# EAGLE design pi-shield (EAGLE 8.2.1)
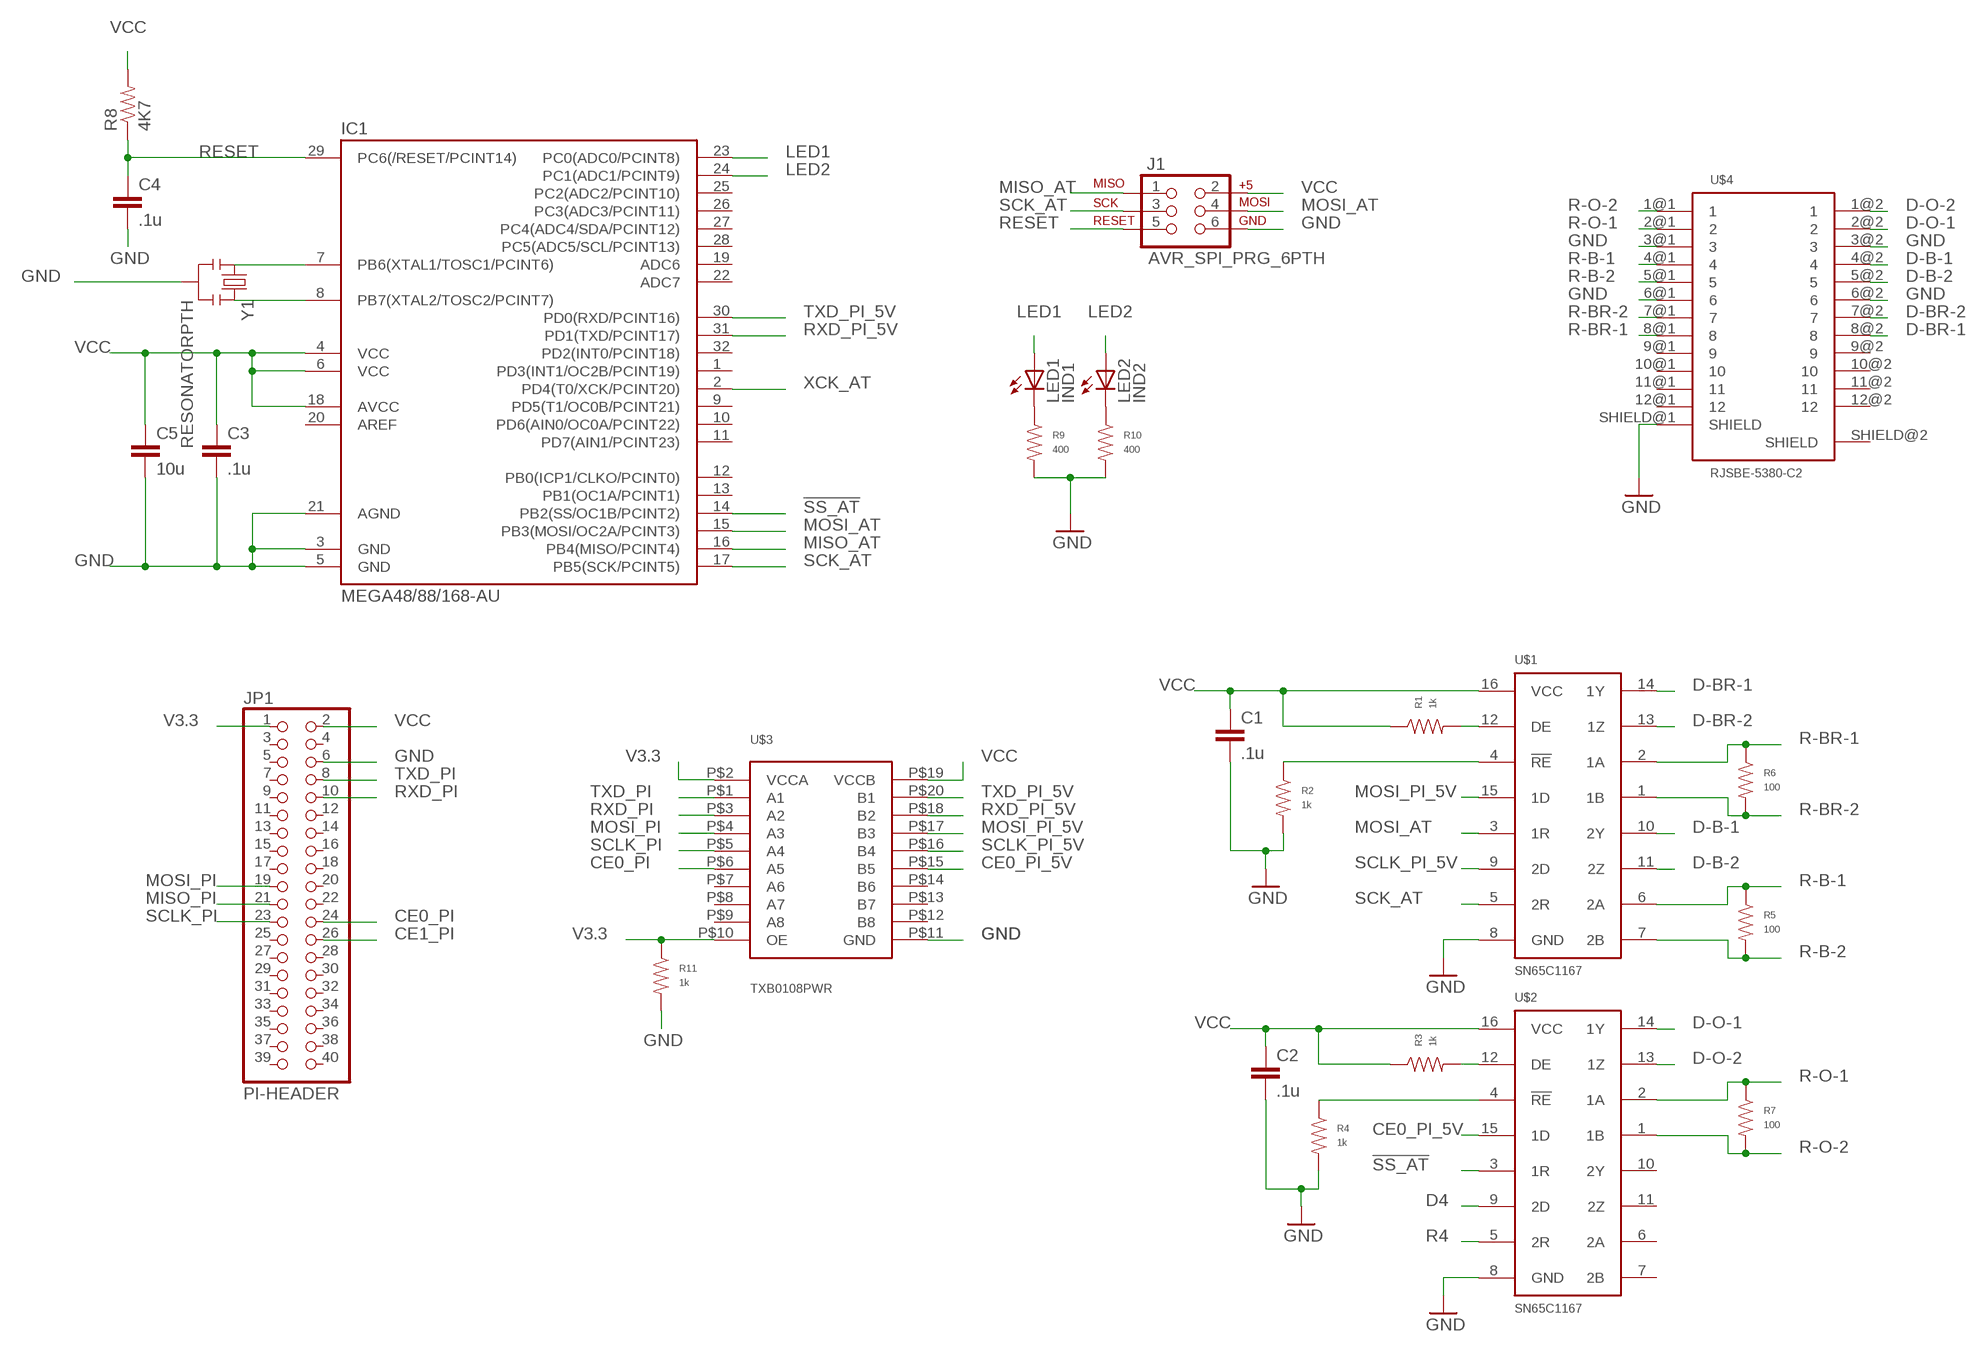
[diagram p0: schematic, sheet 1]

## Parts
C1  .1u  CAP0805  [0805]
C2  .1u  CAP0805  [0805]
C3  .1u  CAP0805  [0805]
C4  .1u  CAP0805  [0805]
C5  10u  CAP0805  [0805]
IC1  MEGA48/88/168-AU  [TQFP32-08]
J1  AVR_SPI_PRG_6PTH  [2X3]
JP1  PI-HEADER  PINHD-2X20  [2X20]
LED1  IND1  LED3MM  [LED3MM]
LED2  IND2  LED3MM  [LED3MM]
R1  1k  RESISTOR_0805  [R0805]
R2  1k  RESISTOR_0805  [R0805]
R3  1k  RESISTOR_0805  [R0805]
R4  1k  RESISTOR_0805  [R0805]
R5  100  RESISTOR_0805  [R0805]
R6  100  RESISTOR_0805  [R0805]
R7  100  RESISTOR_0805  [R0805]
R8  4K7  RESISTOR  [0805]
R9  400  RESISTOR_0805  [R0805]
R10  400  RESISTOR_0805  [R0805]
R11  1k  RESISTOR_0805  [R0805]
U$1  SN65C1167  [SOP-16]
U$2  SN65C1167  [SOP-16]
U$3  TXB0108PWR  [TSSOP20]
U$4  RJSBE-5380-C2  [RJSBE-5380-C2]
Y1  RESONATORPTH  [RESONATOR-PTH]

## Nets
!SS_AT: IC1.14(PB2(SS/OC1B/PCINT2)) U$2.3(1R)
CE0_PI: JP1.24 U$3.P$6(A5)
CE0_PI_5V: U$2.15(1D) U$3.P$15(B5)
CE1_PI: JP1.26
D4: U$2.9(2D)
D-B-1: U$1.10(2Y) U$4.4@2
D-B-2: U$1.11(2Z) U$4.5@2
D-BR-1: U$1.14(1Y) U$4.8@2
D-BR-2: U$1.13(1Z) U$4.7@2
D-O-1: U$2.14(1Y) U$4.2@2
D-O-2: U$2.13(1Z) U$4.1@2
GND: C1.2 C2.2 C3.2 C4.2 C5.2 IC1.3(GND) IC1.5(GND) IC1.21(AGND) J1.6 JP1.6 R2.P$2 R4.P$2 R9.P$2 R10.P$2 R11.P$2 U$1.8(GND) U$2.8(GND) U$3.P$11(GND) U$4.3@1 U$4.3@2 U$4.6@1 U$4.6@2 U$4.SHIELD@1(SHIELD) Y1.2
LED1: IC1.23(PC0(ADC0/PCINT8)) LED1.A
LED2: IC1.24(PC1(ADC1/PCINT9)) LED2.A
MISO_AT: IC1.16(PB4(MISO/PCINT4)) J1.1
MISO_PI: JP1.21
MOSI_AT: IC1.15(PB3(MOSI/OC2A/PCINT3)) J1.4 U$1.3(1R)
MOSI_PI: JP1.19 U$3.P$4(A3)
MOSI_PI_5V: U$1.15(1D) U$3.P$17(B3)
N$1: R1.P$2 U$1.12(DE)
N$3: R2.P$1 U$1.4(!RE)
N$5: R3.P$2 U$2.12(DE)
N$6: R4.P$1 U$2.4(!RE)
N$9: LED1.K(C) R9.P$1
N$10: LED2.K(C) R10.P$1
N$11: IC1.7(PB6(XTAL1/TOSC1/PCINT6)) Y1.1
N$12: IC1.8(PB7(XTAL2/TOSC2/PCINT7)) Y1.3
R4: U$2.5(2R)
R-B-1: R5.P$1 U$1.6(2A) U$4.4@1
R-B-2: R5.P$2 U$1.7(2B) U$4.5@1
R-BR-1: R6.P$1 U$1.2(1A) U$4.8@1
R-BR-2: R6.P$2 U$1.1(1B) U$4.7@1
R-O-1: R7.P$1 U$2.2(1A) U$4.2@1
R-O-2: R7.P$2 U$2.1(1B) U$4.1@1
RESET: C4.1 IC1.29(PC6(/RESET/PCINT14)) J1.5 R8.1
RXD_PI: JP1.10 U$3.P$3(A2)
RXD_PI_5V: IC1.31(PD1(TXD/PCINT17)) U$3.P$18(B2)
SCK_AT: IC1.17(PB5(SCK/PCINT5)) J1.3 U$1.5(2R)
SCLK_PI: JP1.23 U$3.P$5(A4)
SCLK_PI_5V: U$1.9(2D) U$3.P$16(B4)
TXD_PI: JP1.8 U$3.P$1(A1)
TXD_PI_5V: IC1.30(PD0(RXD/PCINT16)) U$3.P$20(B1)
V3.3: JP1.1 R11.P$1 U$3.P$2(VCCA) U$3.P$10(OE)
VCC: C1.1 C2.1 C3.1 C5.1 IC1.4(VCC) IC1.6(VCC) IC1.18(AVCC) J1.2 JP1.2 R1.P$1 R3.P$1 R8.2 U$1.16(VCC) U$2.16(VCC) U$3.P$19(VCCB)
XCK_AT: IC1.2(PD4(T0/XCK/PCINT20))
Unconnected: IC1.1(PD3(INT1/OC2B/PCINT19)) IC1.9(PD5(T1/OC0B/PCINT21)) IC1.10(PD6(AIN0/OC0A/PCINT22)) IC1.11(PD7(AIN1/PCINT23)) IC1.12(PB0(ICP1/CLKO/PCINT0)) IC1.13(PB1(OC1A/PCINT1)) IC1.19(ADC6) IC1.20(AREF) IC1.22(ADC7) IC1.25(PC2(ADC2/PCINT10)) IC1.26(PC3(ADC3/PCINT11)) IC1.27(PC4(ADC4/SDA/PCINT12)) IC1.28(PC5(ADC5/SCL/PCINT13)) IC1.32(PD2(INT0/PCINT18)) JP1.3 JP1.4 JP1.5 JP1.7 JP1.9 JP1.11 JP1.12 JP1.13 JP1.14 JP1.15 JP1.16 JP1.17 JP1.18 JP1.20 JP1.22 JP1.25 JP1.27 JP1.28 JP1.29 JP1.30 JP1.31 JP1.32 JP1.33 JP1.34 JP1.35 JP1.36 JP1.37 JP1.38 JP1.39 JP1.40 U$2.6(2A) U$2.7(2B) U$2.10(2Y) U$2.11(2Z) U$3.P$7(A6) U$3.P$8(A7) U$3.P$9(A8) U$3.P$12(B8) U$3.P$13(B7) U$3.P$14(B6) U$4.9@1 U$4.9@2 U$4.10@1 U$4.10@2 U$4.11@1 U$4.11@2 U$4.12@1 U$4.12@2 U$4.SHIELD@2(SHIELD)

## Library data of the parts
C1-C5 = SparkFun:CAP: Capacitor Standard 0603 ceramic capacitor, and 0.1" leaded capacitor.
IC1 = avr-7:MEGA48/88/168
J1 = SparkFun-Connectors:AVR_SPI_PRG_6: AVR ISP 6 Pin This is the reduced ISP connector for AVR programming. Common on Arduino. This footprint will take up less PCB space and can be used with a 10-pin to 6-pin adapter such as SKU: BOB-08508
JP1 = pinhead:PINHD-2X20: PIN HEADER
LED1 LED2 = SparkFun:LED: LEDs Standard schematic elements and footprints for 5mm, 3mm, 1206, and 0603 sized LEDs. 5mm - Spark Fun Electronics SKU : COM-00529 (and others)
R1-R7 R9-R11 = MF_Passives:RESISTOR: Library: MF_Passives Description: Device for Resistors. Manufacture part number (MPN), Voltage, Tolerance, and Wattage Rating can be added via Attributes. Check https://factory.macrofab.com/parts for the house parts list.; POPULATE: 1
R8 = SparkFun:RESISTOR: Resistor Basic schematic elements and footprints for 0603, 1206, and PTH 1/10th watt (small) resistors.
U$1 U$2 = GARTH:SN65C1167
U$3 = GARTH:TXB0108
U$4 = GARTH:RJSBE-5380-C2
Y1 = SparkFun:RESONATOR: Resonator Small SMD resonator. This is the itty bitty 10/20MHz resonators with built in caps. CSTCE10M0G55 and CSTCE20M0V53. Footprint has been reviewed closely but hasn't been tested yet.

## Board
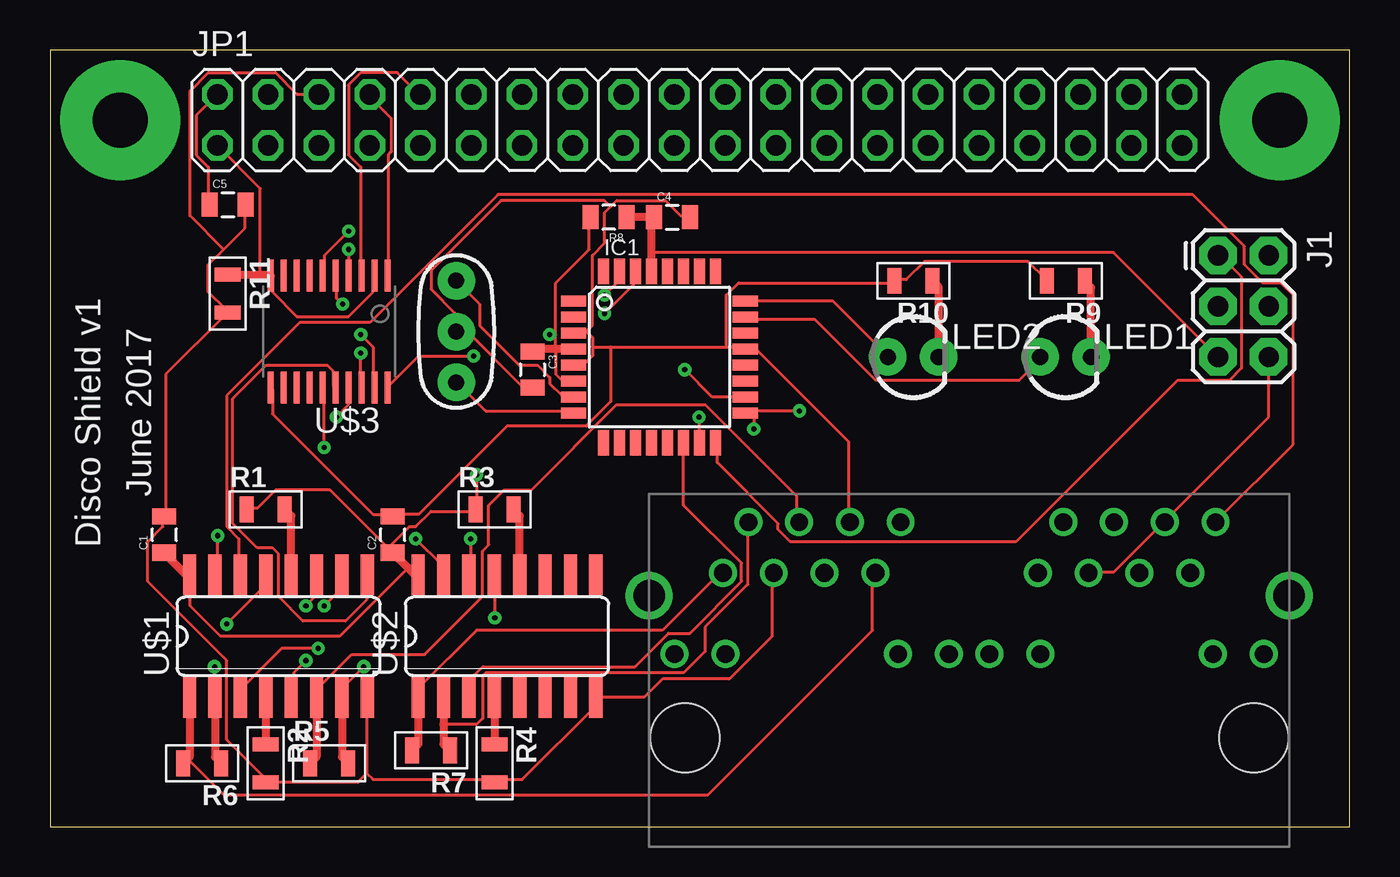
[diagram p1: board, top side]
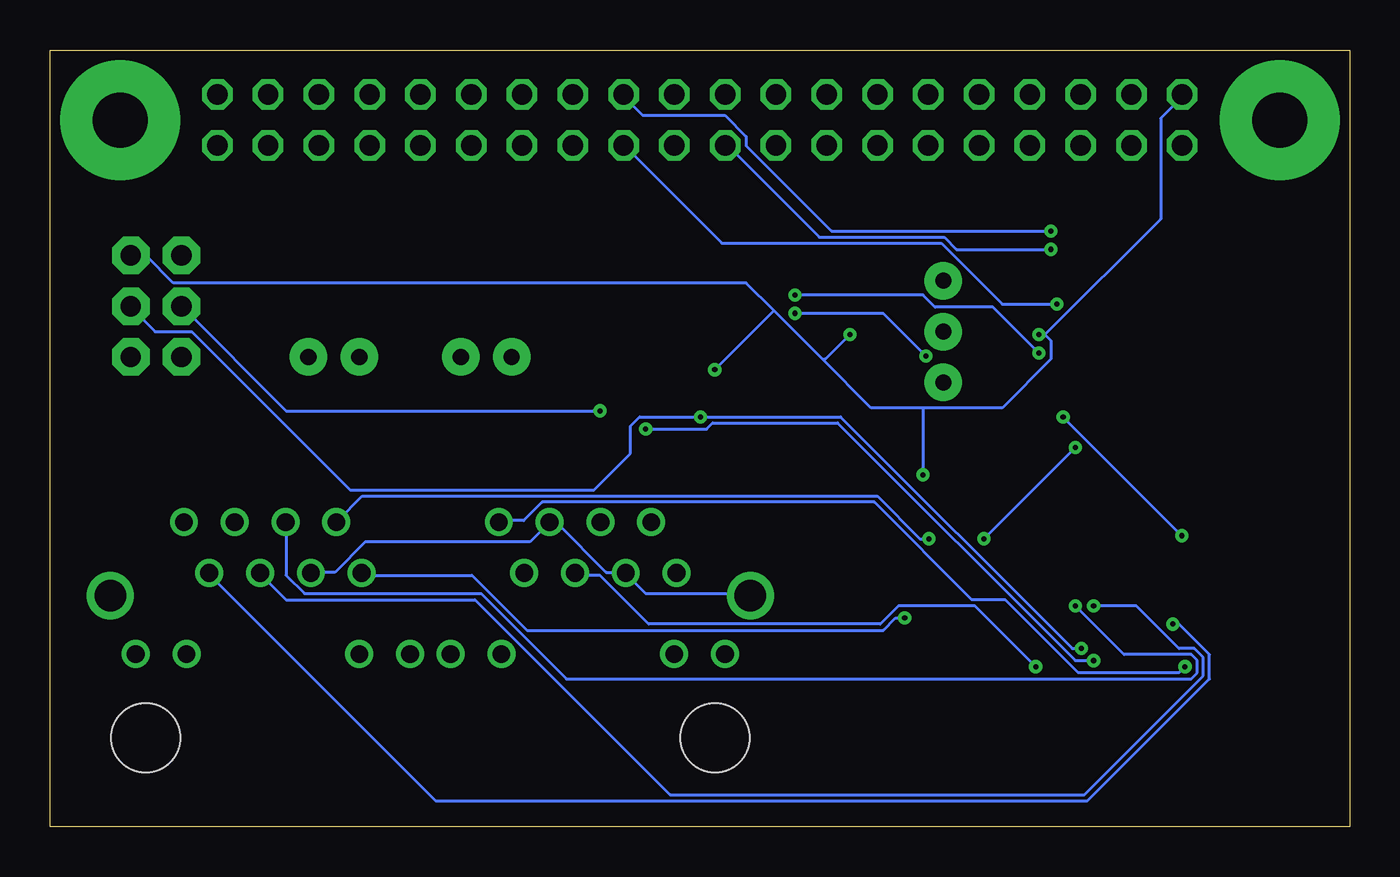
[diagram p2: board, bottom side, seen from below]

Size 65 x 38.85 mm. Coordinates in mm from the lower left corner, seen from the top.
Outline: 0,0 65,0 65,38.85 0,38.85 0,0
Copper layers (1*16): Top 0.035mm / dielectric 1.5mm / Bottom 0.035mm
Design rules "default *": minimum track width 6mil, minimum drill 10mil, track to track 6mil, track to pad 6mil, pad to pad 6mil, via to via 6mil, smd to smd 6mil, copper to edge 40mil, drill to drill 8mil, minimum pad ring 10mil, minimum via ring 8mil, stop-mask expansion 4mil, vias tented up to drill 0mil, thermal gap 10mil

### Footprints (pad centres in the part's own frame; a part is rotated, then mirrored left to right if it is on the bottom)
0805 = smd 0.8 x 1.2: 1 -0.9,0; 2 0.9,0
TQFP32-08 = smd 1.27 x 0.559: 1 -4.293,2.8; 2 -4.293,2; 3 -4.293,1.2; 4 -4.293,0.4; 5 -4.293,-0.4; 6 -4.293,-1.2; 7 -4.293,-2; 8 -4.293,-2.8; 17 4.293,-2.8; 18 4.293,-2; 19 4.293,-1.2; 20 4.293,-0.4; 21 4.293,0.4; 22 4.293,1.2; 23 4.293,2; 24 4.293,2.8 | smd 0.559 x 1.27: 9 -2.8,-4.293; 10 -2,-4.293; 11 -1.2,-4.293; 12 -0.4,-4.293; 13 0.4,-4.293; 14 1.2,-4.293; 15 2,-4.293; 16 2.8,-4.293; 25 2.8,4.293; 26 2,4.293; 27 1.2,4.293; 28 0.4,4.293; 29 -0.4,4.293; 30 -1.2,4.293; 31 -2,4.293; 32 -2.8,4.293
2X3 = drill 1.016 pad 1.88 octagon: 1 0,0; 2 0,2.54; 3 2.54,0; 4 2.54,2.54; 5 5.08,0; 6 5.08,2.54
2X20 = drill 1.016 octagon: 1 -24.13,-1.27; 2 -24.13,1.27; 3 -21.59,-1.27; 4 -21.59,1.27; 5 -19.05,-1.27; 6 -19.05,1.27; 7 -16.51,-1.27; 8 -16.51,1.27; 9 -13.97,-1.27; 10 -13.97,1.27; 11 -11.43,-1.27; 12 -11.43,1.27; 13 -8.89,-1.27; 14 -8.89,1.27; 15 -6.35,-1.27; 16 -6.35,1.27; 17 -3.81,-1.27; 18 -3.81,1.27; 19 -1.27,-1.27; 20 -1.27,1.27; 21 1.27,-1.27; 22 1.27,1.27; 23 3.81,-1.27; 24 3.81,1.27; 25 6.35,-1.27; 26 6.35,1.27; 27 8.89,-1.27; 28 8.89,1.27; 29 11.43,-1.27; 30 11.43,1.27; 31 13.97,-1.27; 32 13.97,1.27; 33 16.51,-1.27; 34 16.51,1.27; 35 19.05,-1.27; 36 19.05,1.27; 37 21.59,-1.27; 38 21.59,1.27; 39 24.13,-1.27; 40 24.13,1.27
LED3MM = drill 0.813 pad 1.88: A -1.27,0; K 1.27,0
R0805 = smd 0.7 x 1.3: P$1 -0.95,0; P$2 0.95,0
SOP-16 = smd 0.66 x 2.032: 1 -4.445,-3.073; 2 -3.175,-3.073; 3 -1.905,-3.073; 4 -0.635,-3.073; 5 0.635,-3.073; 6 1.905,-3.073; 7 3.175,-3.073; 8 4.445,-3.073; 9 4.445,3.073; 10 3.175,3.073; 11 1.905,3.073; 12 0.635,3.073; 13 -0.635,3.073; 14 -1.905,3.073; 15 -3.175,3.073; 16 -4.445,3.073
TSSOP20 = smd 0.3 x 1.6: P$1 -2.925,-2.8; P$2 -2.275,-2.8; P$3 -1.625,-2.8; P$4 -0.975,-2.8; P$5 -0.325,-2.8; P$6 0.325,-2.8; P$7 0.975,-2.8; P$8 1.625,-2.8; P$9 2.275,-2.8; P$10 2.925,-2.8; P$11 2.925,2.8; P$12 2.275,2.8; P$13 1.625,2.8; P$14 0.975,2.8; P$15 0.325,2.8; P$16 -0.325,2.8; P$17 -0.975,2.8; P$18 -1.625,2.8; P$19 -2.275,2.8; P$20 -2.925,2.8
RJSBE-5380-C2 = drill 0.89: 1@1 1.91,8.25; 1@2 17.66,8.25; 2@1 3.18,10.79; 2@2 18.93,10.79; 3@1 4.45,8.25; 3@2 20.2,8.25; 4@1 5.72,10.79; 4@2 21.47,10.79; 5@1 6.99,8.25; 5@2 22.74,8.25; 6@1 8.26,10.79; 6@2 24.01,10.79; 7@1 9.53,8.25; 7@2 25.28,8.25; 8@1 10.8,10.79; 8@2 26.55,10.79; 9@1 13.21,4.19; 9@2 28.96,4.19; 10@1 10.67,4.19; 10@2 26.42,4.19; 11@1 2.03,4.19; 11@2 17.78,4.19; 12@1 -0.51,4.19; 12@2 15.24,4.19 | drill 1.57: SHIELD@1 -1.78,7.11; SHIELD@2 30.23,7.11 | hole 3.45: 0,0; 28.45,0
RESONATOR-PTH = drill 0.8 pad 1.88: 1 -2.54,0; 2 0,0; 3 2.54,0

### Placement (x,y rotation side)
C1  5.71,14.61 90 top
C2  17.14,14.61 90 top
C3  24.13,22.86 270 top
C4  31.11,30.48 0 top
C5  8.89,31.11 0 top
IC1  30.48,23.5 0 top
J1  58.42,28.57 270 top
JP1  32.5,35.35 0 top
LED1  50.8,23.5 0 top
LED2  43.18,23.5 0 top
R1  10.79,15.88 0 top
R2  10.79,3.17 270 top
R3  22.23,15.88 0 top
R4  22.23,3.17 270 top
R5  13.97,3.17 0 top
R6  7.62,3.17 180 top
R7  19.05,3.81 180 top
R8  27.94,30.48 180 top
R9  50.8,27.3 180 top
R10  43.18,27.3 180 top
R11  8.89,26.67 270 top
U$1  11.43,9.53 0 top
U$2  22.86,9.53 0 top
U$3  13.97,24.77 180 top
U$4  31.75,4.45 0 top
Y1  20.32,24.77 270 top

### Tracks (layer width: path | path; a pad name or v marks a point on that pad's centre or on a via)
!SS_AT
  Top 0.152: IC1.14 31.7,19.13 31.7,16.08 34.59,13.18 34.59,12.27 32,9.68 30.94,9.68 29.26,8 21.64,8 21.03,7.39 21.03,6.48 U$2.3
CE0_PI  (via drill 0.25)
  Top 0.152: v14.94,29.79 13.72,28.57 13.72,27.66 U$3.P$6
  Bottom 0.152: v14.94,29.79 25.91,29.79 30.18,34.06 30.18,34.52 31.24,35.59 35.36,35.59 36.27,36.5 JP1.24
CE0_PI_5V  (via drill 0.25)
  Top 0.152: v13.72,18.97 13.72,21.87 U$3.P$15 | v18.29,14.4 19.66,13.03 19.66,12.72 U$2.15
  Bottom 0.152: v18.29,14.4 v13.72,18.97
D-B-1  (via drill 0.25)
  Top 0.152: v13.72,11.05 14.48,11.81 14.48,12.57 U$1.10
  Bottom 0.152: v13.72,11.05 11.28,8.61 7.92,8.61 7.62,8.31 7.62,7.7 7.92,7.39 39.17,7.39 43.43,11.66 52.27,11.66 53.19,12.57 53.19,15.16 U$4.4@2
D-B-2  (via drill 0.25)
  Top 0.152: v12.8,11.05 13.26,11.51 13.26,12.57 U$1.11
  Bottom 0.152: v12.8,11.05 10.67,11.05 8.53,8.91 7.77,8.91 7.32,8.46 7.32,7.54 13.26,1.6 33.98,1.6 43.74,11.35 53.19,11.35 54.41,12.57 U$4.5@2
D-BR-1
  Top 0.152: U$1.14 9.45,12.72 9.45,14.4 8.84,15.01 8.84,21.57 12.5,25.22 16,25.22 22.4,31.62 57.15,31.62 59.74,29.03 59.74,28.12 60.66,27.2 61.57,27.2 62.18,26.59 62.18,19.13 58.37,15.32 U$4.8@2
D-BR-2  (via drill 0.25)
  Top 0.152: v8.84,10.13 10.67,11.96 10.67,12.57 U$1.13
  Bottom 0.152: v8.84,10.13 8.53,10.13 7.01,8.61 7.01,7.39 13.11,1.29 45.72,1.29 57,12.57 U$4.7@2
D-O-1  (via drill 0.25)
  Top 0.152: v21.03,14.4 21.03,12.72 U$2.14
  Bottom 0.152: v21.03,14.4 21.49,14.4 23.62,16.54 49.38,16.54 50.6,15.32 U$4.2@2
D-O-2  (via drill 0.25)
  Top 0.152: v22.25,10.44 22.25,12.57 U$2.13
  Bottom 0.152: v22.25,10.44 22.71,10.44 23.32,9.83 41.15,9.83 43.89,12.57 49.38,12.57 U$4.1@2
GND
  Top 0.152: 8.69,28.88 7.92,28.12 7.92,26.75 8.84,25.83 R11.P$2 8.84,25.68 5.79,22.63 5.79,15.62 C1.2 5.64,15.47 5.64,15.01 4.88,14.25 4.88,12.27 8.84,8.31 8.84,4.34 10.82,2.36 R2.P$2 10.82,2.21 15.39,2.21 15.85,2.67 | 8.69,28.88 9.75,29.95 9.75,31.01 C5.2 | 8.69,28.88 7.01,30.56 7.01,36.8 7.92,37.72 11.28,37.72 12.34,36.65 13.41,36.65 JP1.6 | U$4.3@2 51.97,12.72 53.19,12.72 55.63,15.16 U$4.6@2 55.78,15.32 60.96,20.5 J1.6 | 15.85,2.67 15.85,6.33 U$1.8 | 15.85,2.67 16.15,2.36 22.1,2.36 R4.P$2 22.25,2.36 23.62,2.36 27.28,6.02 27.28,6.33 U$2.8 27.43,6.48 29.72,6.48 30.63,7.39 33.98,7.39 36.12,9.53 36.12,12.57 U$4.3@1 | U$3.P$11 11.12,21.87 11.12,20.65 16.15,15.62 17.07,15.62 C2.2 17.22,15.62 18.44,15.62 22.86,20.04 26.82,20.04 28.04,21.26 28.04,24 | C3.2 24.08,22.02 23.62,22.02 20.88,24.77 Y1.2 20.27,24.77 20.27,25.68 19.05,26.9 19.05,27.81 22.55,31.32 27.74,31.32 28.04,31.01 | R9.P$2 49.84,27.36 48.92,28.27 43.74,28.27 42.82,27.36 42.37,27.36 R10.P$2 42.22,27.2 34.44,27.2 33.83,26.59 33.83,24 | 28.04,31.01 27.74,30.71 27.74,29.18 27.13,28.57 27.13,25.07 26.82,24.77 | 28.04,31.01 28.35,31.32 30.79,31.32 31.55,30.56 32,30.56 C4.2 | 26.82,24.77 26.21,24.77 IC1.3 | 27.13,24 27.13,24.46 26.82,24.77 | 27.13,24 27.13,23.55 26.82,23.24 26.21,23.24 IC1.5 | 27.13,24 28.04,24 | 28.04,24 33.83,24 | 33.83,24 34.75,24 IC1.21 34.9,23.85 35.36,23.85 39.93,19.28 39.93,15.32 U$4.6@1
  Bottom 0.152: U$4.SHIELD@1 30.02,11.66 35.2,11.66 36.12,12.57 U$4.3@1 36.27,12.72 37.19,12.72 39.62,15.16 39.93,15.16 U$4.6@1 41,14.25 49.23,14.25 50.75,12.72 51.82,12.72 U$4.3@2
LED1
  Top 0.152: IC1.23 34.9,25.38 38.25,25.38 41.3,22.33 48.46,22.33 49.53,23.39 LED1.A
LED2
  Top 0.152: IC1.24 34.9,26.29 39.17,26.29 41.91,23.55 LED2.A
MISO_AT
  Top 0.152: IC1.16 33.38,19.13 33.38,18.21 36.42,15.16 36.42,14.86 37.03,14.25 48.31,14.25 56.39,22.33 58.98,22.33 59.59,22.94 59.59,27.51 58.52,28.57 J1.1
MOSI_AT  (via drill 0.25)
  Top 0.152: v32.46,20.5 32.46,19.28 IC1.15 | v13.41,8.91 11.58,8.91 9.6,6.93 9.6,6.48 U$1.3
  Bottom 0.152: J1.4 60.96,25.98 59.74,24.77 57.91,24.77 49.99,16.84 37.8,16.84 35.97,18.67 35.97,20.04 35.51,20.5 v32.46,20.5 25.45,20.5 13.87,8.91 v13.41,8.91
MOSI_PI  (via drill 0.25)
  Top 0.152: v14.94,28.88 14.94,27.66 U$3.P$4
  Bottom 0.152: v14.94,28.88 19.66,28.88 20.27,29.49 26.52,29.49 31.09,34.06 JP1.19
MOSI_PI_5V  (via drill 0.25)
  Top 0.152: v14.33,20.5 14.94,21.11 14.94,21.87 U$3.P$17 | v8.38,14.55 8.38,12.72 U$1.15
  Bottom 0.152: v8.38,14.55 v14.33,20.5
N$1
  Top 0.406: U$1.12 12.06,15.55 R1.P$2
N$3
  Top 0.406: U$1.4 R2.P$1
N$5
  Top 0.406: U$2.12 23.5,15.55 R3.P$2
N$6
  Top 0.406: U$2.4 R4.P$1
N$7  (via drill 2.75 pad 6)
  other vias: 61.5,35.35
N$8  (via drill 2.75 pad 6)
  other vias: 3.5,35.35
N$9
  Top 0.406: LED1.K 52.07,26.98 R9.P$1
N$10
  Top 0.406: LED2.K 44.45,26.98 R10.P$1
N$11
  Top 0.152: Y1.1 21.49,26.14 21.49,25.07 23.47,23.09 24.38,23.09 24.99,22.48 24.99,22.17 25.6,21.57 26.06,21.57 IC1.7
N$12
  Top 0.152: IC1.8 26.06,20.8 21.79,20.8 20.42,22.17 Y1.3
R-B-1
  Top 0.152: U$4.4@1 37.34,15.32 37.34,16.54 32.77,21.11 28.35,21.11 24.08,16.84 22.71,16.84 21.95,16.08 21.95,14.1 21.64,13.79 21.64,11.51 18.75,8.61 15.09,8.61 13.41,6.93 13.41,6.63 U$1.6
  Top 0.406: U$1.6 13.34,3.49 R5.P$1
R-B-2  (via drill 0.25)
  Top 0.152: v15.7,8 14.63,6.93 14.63,6.63 U$1.7
  Top 0.406: U$1.7 14.61,3.49 R5.P$2
  Bottom 0.152: v15.7,8 18.75,11.05 22.55,11.05 23.47,10.13 35.05,10.13 37.49,12.57 38.71,12.57 U$4.5@1
R-BR-1  (via drill 0.25)
  Top 0.152: v8.23,8 8.23,6.63 U$1.2
  Top 0.406: U$1.2 8.26,3.49 R6.P$1
  Bottom 0.152: v8.23,8 8.53,7.7 13.56,7.7 17.22,11.35 18.9,11.35 23.77,16.23 40.39,16.23 41.3,15.32 42.52,15.32 U$4.8@1
R-BR-2
  Top 0.152: U$4.7@1 41.15,12.57 41.15,9.83 32.92,1.6 8.69,1.6 7.01,3.28 R6.P$2
  Top 0.406: U$1.1 6.99,3.49 R6.P$2
R-O-1
  Top 0.152: 19.68,5.11 21.34,5.11 21.64,5.41 21.64,7.54 21.79,7.7 31.7,7.7 32.77,8.76 32.77,9.98 34.9,12.12 34.9,15.16 U$4.2@1
  Top 0.406: U$2.2 19.68,5.11 19.68,4.12 R7.P$1
R-O-2
  Top 0.152: U$2.1 18.44,6.63 18.44,6.93 21.34,9.83 30.63,9.83 33.53,12.72 U$4.1@1
  Top 0.406: U$2.1 18.41,4.12 R7.P$2
RESET
  Top 0.152: 30.08,28.73 53.19,28.73 J1.5
  Top 0.406: IC1.29 30.08,28.73 30.08,30.34 C4.1 R8.1
RXD_PI
  Top 0.152: U$3.P$3 15.54,27.66 15.54,32.99 14.94,33.6 14.94,37.11 15.54,37.72 17.37,37.72 18.44,36.65 JP1.10
RXD_PI_5V  (via drill 0.25)
  Top 0.152: v27.74,26.59 28.35,27.2 28.35,27.66 IC1.31 | v15.54,23.7 15.54,22.02 U$3.P$18
  Bottom 0.152: v27.74,26.59 21.34,26.59 20.73,25.98 17.83,25.98 v15.54,23.7
SCK_AT  (via drill 0.25)
  Top 0.152: v37.49,20.8 35.2,20.8 | 35.2,20.8 34.9,20.8 IC1.17 35.2,20.8 | v12.8,8.31 12.19,7.7 12.19,6.48 U$1.5 | 35.2,20.8 v35.2,19.89
  Bottom 0.152: v37.49,20.8 53.19,20.8 J1.3 | v12.8,8.31 13.72,8.31 25.6,20.19 31.85,20.19 32.16,19.89 v35.2,19.89
SCLK_PI  (via drill 0.25)
  Top 0.152: v14.63,26.14 14.33,26.44 14.33,27.51 U$3.P$5
  Bottom 0.152: v14.63,26.14 17.37,26.14 20.42,29.18 31.39,29.18 36.27,34.06 JP1.23
SCLK_PI_5V
  Top 0.152: U$3.P$16 14.17,22.02 14.17,22.78 13.87,23.09 10.82,23.09 9.14,21.41 9.14,15.16 10.36,13.95 11.12,13.95 11.43,13.64 11.43,11.51 12.65,10.29 14.78,10.29 15.85,11.35 15.85,12.57 U$1.9
TXD_PI
  Top 0.152: U$3.P$1 16.92,27.66 16.92,33.6 17.07,33.76 17.07,35.43 16,36.5 JP1.8
TXD_PI_5V  (via drill 0.25)
  Top 0.152: v27.74,25.68 29.26,27.2 29.26,27.66 IC1.30 | v21.18,23.55 18.44,23.55 16.92,22.02 U$3.P$20
  Bottom 0.152: v27.74,25.68 23.32,25.68 v21.18,23.55
V3.3
  Top 0.152: U$3.P$2 16.15,27.51 16.15,26.75 14.94,25.53 12.34,25.53 11.12,26.75 11.12,27.51 U$3.P$10 | 10.52,27.62 10.52,31.93 8.38,34.06 JP1.1
  Top 0.406: R11.P$1 10.52,27.62 10.99,27.62 U$3.P$10
VCC  (via drill 0.25)
  Top 0.152: 16.92,13.95 17.07,13.79 C2.1 16.92,13.95 | 16.92,13.95 14.02,16.84 11.28,16.84 10.36,15.93 9.91,15.93 R1.P$1 | 16.92,13.95 17.98,15.01 18.29,15.01 19.05,15.77 21.18,15.77 R3.P$1 21.34,15.93 v21.34,17.6 | 17.9,12.95 14.48,9.53 8.53,9.53 7.01,11.05 7.01,12.42 U$1.16 | 25.3,24.61 25.3,23.89 25.3,22.63 25.6,22.33 26.06,22.33 IC1.6 | 25.3,24.61 25.3,27.2 26.98,28.88 26.98,30.4 R8.2 | C5.1 7.92,31.17 7.92,32.99 7.32,33.6 7.32,35.59 8.23,36.5 JP1.2 | v15.54,24.61 16.15,24 16.15,22.02 U$3.P$19 | v24.99,24.61 25.3,24.61 | IC1.18 33.12,21.5 v31.75,22.86
  Top 0.406: IC1.4 25.3,23.89 24.27,23.89 C3.1 | U$2.16 18.25,12.6 17.9,12.95 C2.1 | U$1.16 6.82,12.6 C1.1
  Bottom 0.152: 15.24,24.61 9.45,30.4 9.45,35.43 8.38,36.5 JP1.2 | J1.2 60.2,28.57 58.83,27.2 30.18,27.2 28.79,25.82 | 26.36,23.39 23.93,20.95 21.34,20.95 | 28.79,25.82 26.36,23.39 | 21.34,20.95 17.37,20.95 14.94,23.39 14.94,24.31 15.24,24.61 | 15.24,24.61 v15.54,24.61 | v24.99,24.61 26.21,23.39 26.36,23.39 | 21.34,20.95 v21.34,17.6 | v31.75,22.86 28.79,25.82

### Text on the board
tPlace: June 2017 | Disco Shield v1